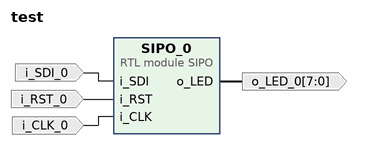
[diagram p0: block diagram of the top level]
# Vivado block design test, xc7z007sclg400-1, Vivado 2018.2
create_bd_design test

create_bd_port -dir I i_SDI_0
create_bd_port -dir I -type rst i_RST_0
create_bd_port -dir I -type clk i_CLK_0
create_bd_port -dir O -from 7 -to 0 o_LED_0

create_bd_cell -type module -reference SIPO SIPO_0

# ---- connections ----

connect_bd_net -net i_SDI_0_1 [get_bd_ports i_SDI_0] [get_bd_pins SIPO_0/i_SDI]
connect_bd_net -net i_RST_0_1 [get_bd_ports i_RST_0] [get_bd_pins SIPO_0/i_RST]
connect_bd_net -net i_CLK_0_1 [get_bd_ports i_CLK_0] [get_bd_pins SIPO_0/i_CLK]
connect_bd_net [get_bd_pins SIPO_0/o_LED] [get_bd_ports o_LED_0]

validate_bd_design
save_bd_design
